# Altium project MultiRotor.PrjPCB
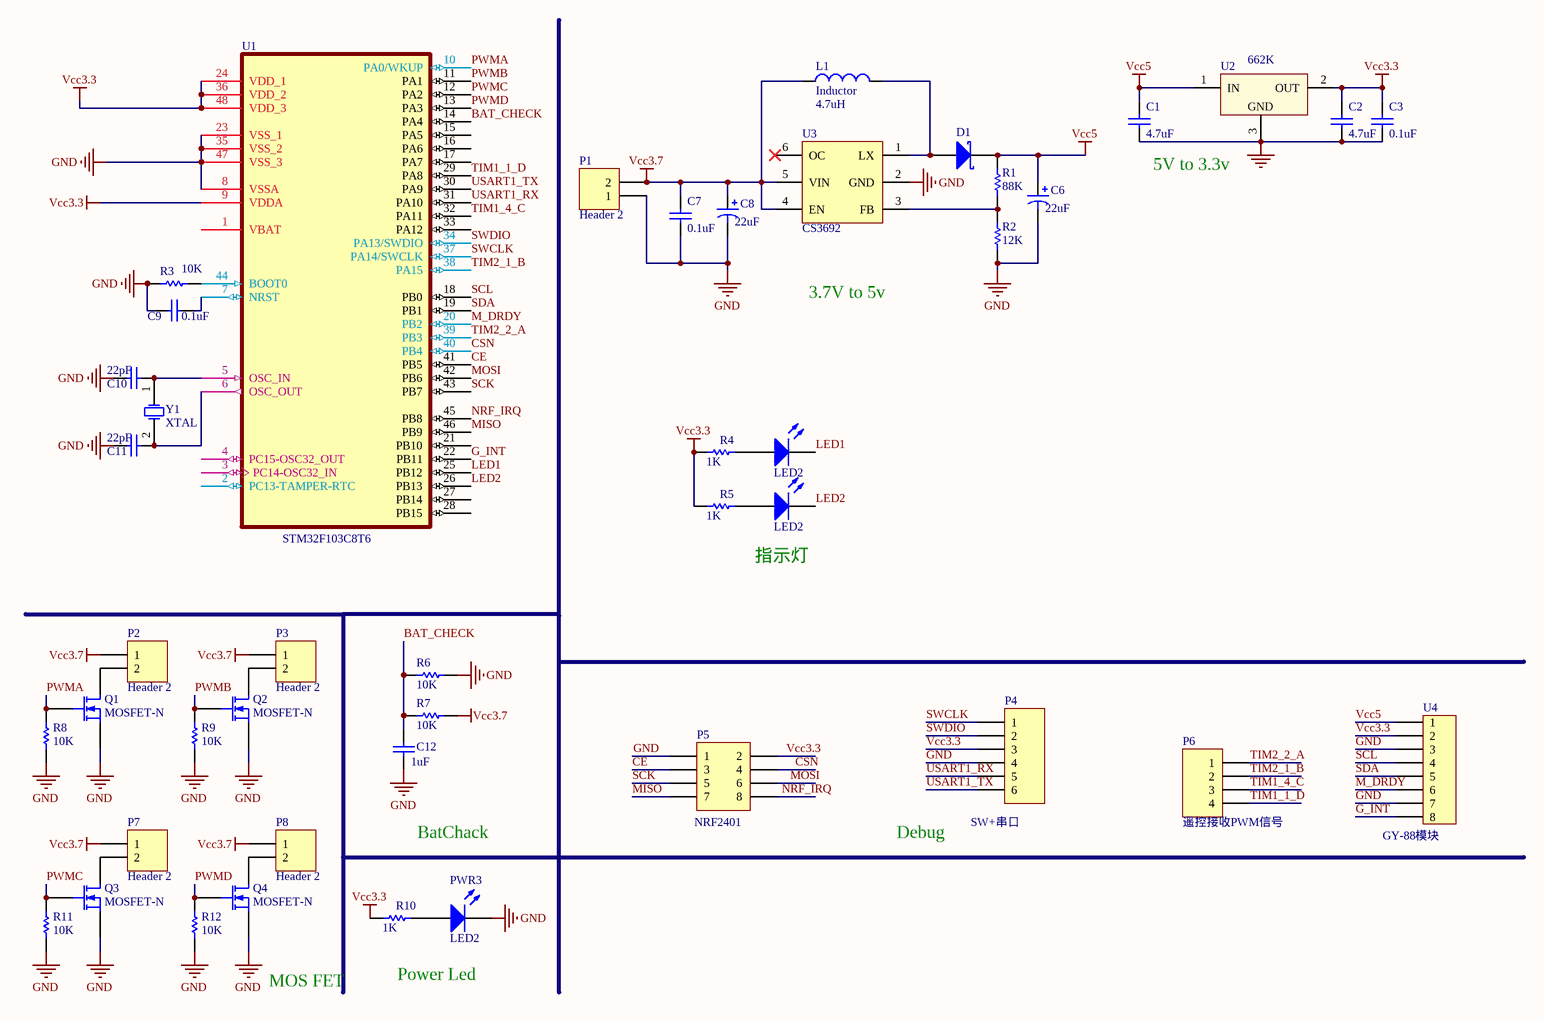
[diagram p0: MultiRotor_v0.1.SchDoc]
1 sheet, 44 parts. Net scope: global (net labels, ports and power ports of the same name join across sheets).
Board file: MultiRotor_v0.3.PcbDoc

## Sheet MultiRotor_v0.1.SchDoc
size A3

### Parts
C1  value 4.7uF  [CAP[1206]]  (hidden comment: Cap Pol1)
C2  value 4.7uF  [CAP[1206]]  (hidden comment: Cap Pol1)
C3  value 0.1uF  [CAP[0805]]  (hidden comment: Cap)
C6  value 22uF  [CAP[1206]]  (hidden comment: Cap)
C7  value 0.1uF  [CAP[0805]]  (hidden comment: Cap)
C8  value 22uF  [CAP[1206]]  (hidden comment: Cap)
C9  value 0.1uF  [CAP[0805]]  (hidden comment: Cap)
C10  value 22pF  [CAP[0805]]  (hidden comment: Cap)
C11  value 22pF  [CAP[0805]]  (hidden comment: Cap)
C12  value 1uF  [CAP[0805]]  (hidden comment: Cap)
D1  1n5819  [DO-214AC - Diode]  (value not drawn)
L1  Inductor  [Inductor_T10uH]
P1  Header 2  [H2.54-1X2]
P2  Header 2  [H2.54-1X2]
P3  Header 2  [H2.54-1X2]
P4  SW+串口  [HDR1X6]
P5  NRF2401  [NRF(2401)模块]
P6  遥控接收PWM信号  [H2.54-1X4]
P7  Header 2  [H2.54-1X2]
P8  Header 2  [H2.54-1X2]
PWR1  LED2  [LED[0805]]
PWR2  LED2  [LED[0805]]
PWR3  LED2  [LED[0805]]
Q1  MOSFET-N  [SOT23]
Q2  MOSFET-N  [SOT23]
Q3  MOSFET-N  [SOT23]
Q4  MOSFET-N  [SOT23]
R1  value 88K  [RES[0805]]  (hidden comment: Res1)
R2  value 12K  [RES[0805]]  (hidden comment: Res1)
R3  value 10K  [RES[0805]]  (hidden comment: Res1)
R4  value 1K  [RES[0805]]  (hidden comment: Res1)
R5  value 1K  [RES[0805]]  (hidden comment: Res1)
R6  value 10K  [RES[0805]]  (hidden comment: Res1)
R7  value 10K  [RES[0805]]  (hidden comment: Res1)
R8  value 10K  [RES[0805]]  (hidden comment: Res1)
R9  value 10K  [RES[0805]]  (hidden comment: Res1)
R10  value 1K  [RES[0805]]  (hidden comment: Res1)
R11  value 10K  [RES[0805]]  (hidden comment: Res1)
R12  value 10K  [RES[0805]]  (hidden comment: Res1)
U1  STM32F103C8T6  [LQFP-48]
U2  662K  [SOT23]
U3  CS3692  [SOT23-6]
U4  GY-88模块  [MPU-6050]
Y1  XTAL  [XTAL]

### Nets
GND: C1.1 C2.1 C3.1 C6.2 C7.1 C8.2 C9.2 C10.2 C11.2 C12.1 P1.1 P4.4 P5.1 PWR3.2(K) Q1.3(S) Q2.3(S) Q3.3(S) Q4.3(S) R2.2 R3.2 R6.1 R8.1 R9.1 R11.1 R12.1 U1.8(VSSA) U1.23(VSS_1) U1.35(VSS_2) U1.47(VSS_3) U2.3(GND) U3.2(GND) U4.3 U4.7
Vcc3.3: C2.2 C3.2 P4.3 P5.2 R4.2 R5.2 R10.2 U1.9(VDDA) U1.24(VDD_1) U1.36(VDD_2) U1.48(VDD_3) U2.2(OUT) U4.2
Vcc3.7: C7.2 C8.1 L1.1 P1.2 P2.1 P3.1 P7.1 P8.1 R7.1 U3.4(EN) U3.5(VIN)
Vcc5: C1.2 C6.1 D1.2(K) R1.1 U2.1(IN) U4.1
BAT_CHECK: C12.2 R6.2 R7.2 U1.14(PA4)
CE: P5.3 U1.41(PB5)
CSN: P5.4 U1.40(PB4)
G_INT: U1.22(PB11) U4.8
LED1: PWR1.2(K) U1.25(PB12)
LED2: PWR2.2(K) U1.26(PB13)
M_DRDY: U1.20(PB2) U4.6
MISO: P5.7 U1.46(PB9)
MOSI: P5.6 U1.42(PB6)
NRF_IRQ: P5.8 U1.45(PB8)
PWMA: Q1.2(G) R8.2 U1.10(PA0/WKUP)
PWMB: Q2.2(G) R9.2 U1.11(PA1)
PWMC: Q3.2(G) R11.2 U1.12(PA2)
PWMD: Q4.2(G) R12.2 U1.13(PA3)
SCK: P5.5 U1.43(PB7)
SCL: U1.18(PB0) U4.4
SDA: U1.19(PB1) U4.5
SWCLK: P4.1 U1.37(PA14/SWCLK)
SWDIO: P4.2 U1.34(PA13/SWDIO)
TIM1_1_D: P6.4 U1.29(PA8)
TIM1_4_C: P6.3 U1.32(PA11)
TIM2_1_B: P6.2 U1.38(PA15)
TIM2_2_A: P6.1 U1.39(PB3)
USART1_RX: P4.5 U1.31(PA10)
USART1_TX: P4.6 U1.30(PA9)
NetC9_1: C9.1 U1.7(NRST)
NetC10_1: C10.1 U1.5(OSC_IN) Y1.1(OSC1)
NetC11_1: C11.1 U1.6(OSC_OUT) Y1.2(OSC2)
NetD1_1: D1.1(A) L1.2 U3.1(LX)
NetP2_2: P2.2 Q1.1(D)
NetP3_2: P3.2 Q2.1(D)
NetP7_2: P7.2 Q3.1(D)
NetP8_2: P8.2 Q4.1(D)
NetPWR1_1: PWR1.1(A) R4.1
NetPWR2_1: PWR2.1(A) R5.1
NetPWR3_1: PWR3.1(A) R10.1
NetR1_2: R1.2 R2.1 U3.3(FB)
NetR3_1: R3.1 U1.44(BOOT0)

Not connected (* = marked no-connect by the designer): U1 1(VBAT) 2(PC13-TAMPER-RTC) 3(PC14-OSC32_IN) 4(PC15-OSC32_OUT) 15(PA5) 16(PA6) 17(PA7) 21(PB10) 27(PB14) 28(PB15) 33(PA12); U3 6(OC)*

### Notes on the sheet
- 5V to 3.3v
- 3.7V to 5v
- 指示灯
- BatChack
- Debug
- MOS FET
- Power Led
- (in symbol Inductor) 4.7uH

### Library data of the parts
C1-C3 C7 C9-C12 = Cap: Capacitor; Published: 8-Jun-2000; LatestRevisionDate: 17-Jul-2002; LatestRevisionNote: Re-released for DXP Platform.; Publisher: Altium Limited; PackageReference: RAD-0.3; PackageDescription: Radial Cap, Thru-Hole; 2 Leads; 0.3 in Pin Spacing
C6 C8 = Cap Pol1: Polarized Capacitor (Radial); Published: 8-Jun-2000; LatestRevisionDate: 17-Jul-2002; LatestRevisionNote: Re-released for DXP Platform.; Publisher: Altium Limited; PackageReference: RB7.6-15; PackageDescription: Polarized Capacitor (Radial); 2 Leads
D1 = Diode_P6KE
P1-P3 P7 P8 = Header 2: Header, 2-Pin; LatestRevisionDate: 17-Jul-2002; LatestRevisionNote: Re-released for DXP Platform.; Publisher: Altium Limited
P4 = Header 6: Header, 6-Pin; LatestRevisionDate: 17-Jul-2002; LatestRevisionNote: Re-released for DXP Platform.; Publisher: Altium Limited
P5 = Header 4X2: Header, 4-Pin, Dual row; LatestRevisionDate: 17-Jul-2002; LatestRevisionNote: Re-released for DXP Platform.; Publisher: Altium Limited
P6 = Header 4: Header, 4-Pin; LatestRevisionDate: 17-Jul-2002; LatestRevisionNote: Re-released for DXP Platform.; Publisher: Altium Limited
PWR1-PWR3 = LED2: Typical RED, GREEN, YELLOW, AMBER GaAs LED; Published: 8-Jun-2000; LatestRevisionDate: 17-Jul-2002; LatestRevisionNote: Re-released for DXP Platform.; PackageVersion: Feb-2002; PackageReference: 3.2X1.6X1.1; Publisher: Altium Limited; PackageDescription: SM LED; 2 Flat Leads
Q1-Q4 = MOSFET-N: N-Channel MOSFET; Published: 8-Jun-2000; LatestRevisionDate: 17-Jul-2002; LatestRevisionNote: Re-released for DXP Platform.; PackageVersion: 1995/1996; PackageReference: E3; Publisher: Altium Limited; PackageDescription: TO, Flat Index; 3 In-Line, Axial Leads; Body Dia. 4.6mm; Lead Dia. 0.5 mm (max)
R1-R12 = Res1: Resistor; Published: 8-Jun-2000; LatestRevisionDate: 17-Jul-2002; LatestRevisionNote: Re-released for DXP Platform.; PackageReference: AXIAL-0.3; Publisher: Altium Limited; PackageDescription: Axial Device, Thru-Hole; 2 Leads; 0.3 in Pin Spacing
U1 = STM32F103C8T6: STM32 ARM-based 32-bit MCU with 64 Kbytes Flash, 48-pin LQFP, Industrial Temperature; Published: *; DatasheetVersion: *; PackageVersion: *; PackageReference: *; Publisher: *; PackageDescription: *; ComponentLink1Description: *; ComponentLink1URL: *; ComponentLink2Description: *; ComponentLink2URL: *
U2 = AMS1117-3.3
U3 = CS3692: Generic Phase Locked Loop; Published: 8-Jun-2000; LatestRevisionDate: 29-May-2009; LatestRevisionNote: IPC-7351 Footprint Added.; PackageVersion: May-1999; PackageReference: DB008; Publisher: Altium Limited; PackageDescription: 8-Pin Plastic Small Outline Package 0.65 mm Pitch; Code_JEDEC: MO-150-AA; Code_IPC: SOP65P780-8
U4 = MPU-6050模块
Y1 = XTAL: Crystal Oscillator; Published: 8-Jun-2000; LatestRevisionDate: 17-Jul-2002; LatestRevisionNote: Re-released for DXP Platform.; PackageReference: R38; Publisher: Altium Limited; PackageDescription: Crystal, Thru-Hole; 2 Leads; Body 3.1 x 8.2 mm (Dia.xH)